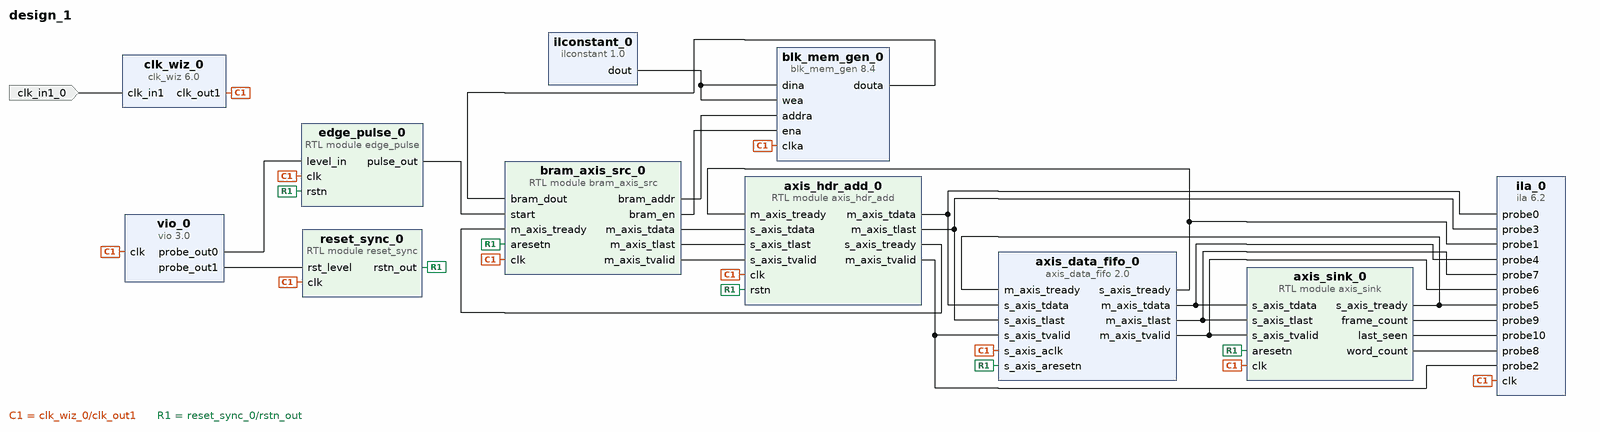
[diagram p0: block diagram of the top level]
# Vivado block design design_1, xc7z015clg485-1, Vivado 2025.1
create_bd_design design_1

create_bd_port -dir I -type clk clk_in1_0

create_bd_cell -type ip -vlnv xilinx.com:ip:clk_wiz:6.0 clk_wiz_0
set_property -dict [list \
  CONFIG.CLKOUT1_DRIVES BUFG \
  CONFIG.CLKOUT1_JITTER 130.958 \
  CONFIG.CLKOUT1_PHASE_ERROR 98.575 \
  CONFIG.CLKOUT2_DRIVES BUFG \
  CONFIG.CLKOUT3_DRIVES BUFG \
  CONFIG.CLKOUT4_DRIVES BUFG \
  CONFIG.CLKOUT5_DRIVES BUFG \
  CONFIG.CLKOUT6_DRIVES BUFG \
  CONFIG.CLKOUT7_DRIVES BUFG \
  CONFIG.FEEDBACK_SOURCE FDBK_AUTO \
  CONFIG.MMCM_BANDWIDTH OPTIMIZED \
  CONFIG.MMCM_CLKFBOUT_MULT_F 10.000 \
  CONFIG.MMCM_CLKOUT0_DIVIDE_F 10.000 \
  CONFIG.MMCM_COMPENSATION ZHOLD \
  CONFIG.PRIMITIVE MMCM \
  CONFIG.USE_LOCKED false \
  CONFIG.USE_RESET false \
] [get_bd_cells clk_wiz_0]
create_bd_cell -type module -reference axis_hdr_add axis_hdr_add_0
create_bd_cell -type ip -vlnv xilinx.com:ip:vio:3.0 vio_0
set_property -dict {CONFIG.C_NUM_PROBE_OUT 2} [get_bd_cells vio_0]
create_bd_cell -type module -reference reset_sync reset_sync_0
create_bd_cell -type module -reference edge_pulse edge_pulse_0
create_bd_cell -type ip -vlnv xilinx.com:ip:axis_data_fifo:2.0 axis_data_fifo_0
set_property -dict {CONFIG.HAS_TLAST 1 CONFIG.TDATA_NUM_BYTES 4} [get_bd_cells axis_data_fifo_0]
create_bd_cell -type module -reference axis_sink axis_sink_0
create_bd_cell -type ip -vlnv xilinx.com:ip:ila:6.2 ila_0
set_property -dict [list \
  CONFIG.C_MONITOR_TYPE Native \
  CONFIG.C_NUM_OF_PROBES 11 \
  CONFIG.C_PROBE0_WIDTH 32 \
  CONFIG.C_PROBE4_WIDTH 32 \
  CONFIG.C_PROBE8_WIDTH 32 \
  CONFIG.C_PROBE9_WIDTH 32 \
] [get_bd_cells ila_0]
create_bd_cell -type module -reference bram_axis_src bram_axis_src_0
create_bd_cell -type ip -vlnv xilinx.com:ip:blk_mem_gen:8.4 blk_mem_gen_0
set_property -dict [list \
  CONFIG.Coe_File ../payload_1k_32b.coe \
  CONFIG.Load_Init_File true \
  CONFIG.Memory_Type True_Dual_Port_RAM \
  CONFIG.Write_Depth_A 1024 \
  CONFIG.use_bram_block Stand_Alone \
] [get_bd_cells blk_mem_gen_0]
create_bd_cell -type inline_hdl -vlnv xilinx.com:inline_hdl:ilconstant:1.0 ilconstant_0
set_property -dict {CONFIG.CONST_VAL 0} [get_bd_cells ilconstant_0]

# ---- connections ----

connect_bd_net [get_bd_pins axis_data_fifo_0/m_axis_tdata] [get_bd_pins axis_sink_0/s_axis_tdata] [get_bd_pins ila_0/probe4]
connect_bd_net [get_bd_pins axis_data_fifo_0/m_axis_tlast] [get_bd_pins axis_sink_0/s_axis_tlast] [get_bd_pins ila_0/probe7]
connect_bd_net [get_bd_pins axis_data_fifo_0/m_axis_tvalid] [get_bd_pins axis_sink_0/s_axis_tvalid] [get_bd_pins ila_0/probe6]
connect_bd_net [get_bd_pins axis_data_fifo_0/s_axis_tready] [get_bd_pins axis_hdr_add_0/m_axis_tready] [get_bd_pins ila_0/probe1]
connect_bd_net [get_bd_pins axis_hdr_add_0/m_axis_tdata] [get_bd_pins axis_data_fifo_0/s_axis_tdata] [get_bd_pins ila_0/probe0]
connect_bd_net [get_bd_pins axis_hdr_add_0/m_axis_tlast] [get_bd_pins axis_data_fifo_0/s_axis_tlast] [get_bd_pins ila_0/probe3]
connect_bd_net [get_bd_pins axis_hdr_add_0/m_axis_tvalid] [get_bd_pins axis_data_fifo_0/s_axis_tvalid] [get_bd_pins ila_0/probe2]
connect_bd_net [get_bd_pins axis_hdr_add_0/s_axis_tready] [get_bd_pins bram_axis_src_0/m_axis_tready]
connect_bd_net [get_bd_pins axis_sink_0/frame_count] [get_bd_pins ila_0/probe9]
connect_bd_net [get_bd_pins axis_sink_0/last_seen] [get_bd_pins ila_0/probe10]
connect_bd_net [get_bd_pins axis_sink_0/s_axis_tready] [get_bd_pins axis_data_fifo_0/m_axis_tready] [get_bd_pins ila_0/probe5]
connect_bd_net [get_bd_pins axis_sink_0/word_count] [get_bd_pins ila_0/probe8]
connect_bd_net [get_bd_pins blk_mem_gen_0/douta] [get_bd_pins bram_axis_src_0/bram_dout]
connect_bd_net [get_bd_pins bram_axis_src_0/bram_addr] [get_bd_pins blk_mem_gen_0/addra]
connect_bd_net [get_bd_pins bram_axis_src_0/bram_en] [get_bd_pins blk_mem_gen_0/ena]
connect_bd_net [get_bd_pins bram_axis_src_0/m_axis_tdata] [get_bd_pins axis_hdr_add_0/s_axis_tdata]
connect_bd_net [get_bd_pins bram_axis_src_0/m_axis_tlast] [get_bd_pins axis_hdr_add_0/s_axis_tlast]
connect_bd_net [get_bd_pins bram_axis_src_0/m_axis_tvalid] [get_bd_pins axis_hdr_add_0/s_axis_tvalid]
connect_bd_net -net clk_in1_0_1 [get_bd_ports clk_in1_0] [get_bd_pins clk_wiz_0/clk_in1]
connect_bd_net [get_bd_pins clk_wiz_0/clk_out1] \
  [get_bd_pins vio_0/clk] [get_bd_pins reset_sync_0/clk] [get_bd_pins edge_pulse_0/clk] \
  [get_bd_pins axis_data_fifo_0/s_axis_aclk] [get_bd_pins axis_hdr_add_0/clk] [get_bd_pins axis_sink_0/clk] \
  [get_bd_pins ila_0/clk] [get_bd_pins blk_mem_gen_0/clka] [get_bd_pins bram_axis_src_0/clk]
connect_bd_net [get_bd_pins edge_pulse_0/pulse_out] [get_bd_pins bram_axis_src_0/start]
connect_bd_net [get_bd_pins ilconstant_0/dout] [get_bd_pins blk_mem_gen_0/dina] [get_bd_pins blk_mem_gen_0/wea]
connect_bd_net [get_bd_pins reset_sync_0/rstn_out] \
  [get_bd_pins edge_pulse_0/rstn] [get_bd_pins axis_data_fifo_0/s_axis_aresetn] [get_bd_pins axis_hdr_add_0/rstn] \
  [get_bd_pins axis_sink_0/aresetn] [get_bd_pins bram_axis_src_0/aresetn]
connect_bd_net [get_bd_pins vio_0/probe_out0] [get_bd_pins edge_pulse_0/level_in]
connect_bd_net [get_bd_pins vio_0/probe_out1] [get_bd_pins reset_sync_0/rst_level]

validate_bd_design
save_bd_design
